# Altium project MBoard.PrjPcb (part 2 of 2)

## Sheet fpga-prom.SchDoc: FPGA Program Memory
size A4; Author: GAA; Organization: heig-vd; Address1: heig-vd; Address2: Route de Cheseaux 1; Address3: 1401 Yverdon-les-Bains; Address4: Suisse; DocumentNumber: 5; Revision: 1.1; SheetNumber: 5; SheetTotal: 12
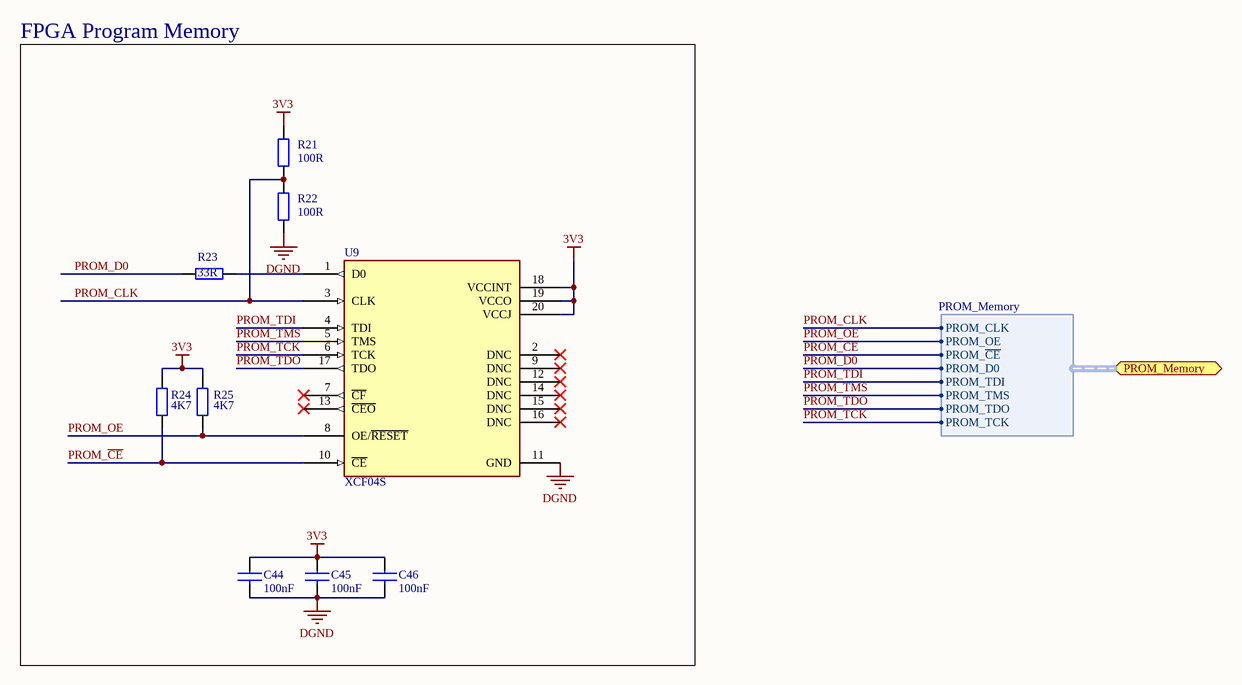
[diagram p7: fpga-prom.SchDoc]

### Parts
C44  100nF  [SM/C_0603]
C45  100nF  [SM/C_0603]
C46  100nF  [SM/C_0603]
R21  100R  [SM/R_0603]
R22  100R  [SM/R_0603]
R23  33R  [SM/R_0603]
R24  4K7  [SM/R_0603]
R25  4K7  [SM/R_0603]
U9  XCF04S  [TSSOP-20]

### Blocks framed on the sheet
FPGA Program Memory: C44-C46 R21-R25 U9

### Ports
PROM_Memory (harness PROM_Memory)

### Harnesses
PROM_Memory: PROM_CLK, PROM_OE, PROM_~{CE}, PROM_D0, PROM_TDI, PROM_TDO, PROM_TCK, PROM_TMS

### Nets
3V3: C44.1 C45.1 C46.1 R21.1 R24.1 R25.1 U9.18(VCCINT) U9.19(VCCO) U9.20(VCCJ)
DGND: C44.2 C45.2 C46.2 R22.2 U9.11(GND)
PROM_~{CE}: R24.2 U9.10(~{CE}) ; port PROM_Memory.PROM_~{CE}  [project net FPGA_DONE_2]
PROM_CLK: R21.2 R22.1 U9.3(CLK) ; port PROM_Memory.PROM_CLK  [project net FPGA_CCLK]
PROM_D0: R23.1 ; port PROM_Memory.PROM_D0  [project net FPGA_DIN]
PROM_OE: R25.2 U9.8(OE/~{RESET}) ; port PROM_Memory.PROM_OE  [project net FPGA_INIT_B]
PROM_TCK: U9.6(TCK) ; port PROM_Memory.PROM_TCK  [project net FPGA_TCK]
PROM_TDI: U9.4(TDI) ; port PROM_Memory.PROM_TDI  [project net FPGA_TDO]
PROM_TDO: U9.17(TDO) ; port PROM_Memory.PROM_TDO  [project net JTAG_TDO]
PROM_TMS: U9.5(TMS) ; port PROM_Memory.PROM_TMS  [project net FPGA_TMS]
NetR23_2: R23.2 U9.1(D0)

Not connected (* = marked no-connect by the designer): U9 2(DNC)* 7(~{CF})* 9(DNC)* 12(DNC)* 13(~{CEO})* 14(DNC)* 15(DNC)* 16(DNC)*

### Notes on the sheet
- Route de Cheseaux 1
- CH-1401 Yverdon-les-Bains
- Titre:
- Date:
- Projet:
- Revision:
- Sheet
- of
- File:

### Library data of the parts
C44-C46 = 182: Ceramic multi-layer; Manufacturer: AVX; Manufacturer P/N: 0603YC104KAZ2A; ID: 182; Voltage: 16V; Tolerance: ±10%; Value: 100nF; Component Type: Capacitor, non-polarized; Supplier 1: Farnell; Supplier Part Number 1: 7569556; RoHS Compliant: True
R21 R22 = 85: Résistance 0603 63mW 1% 100R; Manufacturer: Multicomp; Manufacturer P/N: MC 0.036mW 0603 1% 100R; ID: 85; Voltage: 50V; Value: 100R; Component Type: Résistance; Power: 63mW; Tolerance: 1%; Supplier 1: Farnell; Supplier Part Number 1: 9330364; RoHS Compliant: False
R23 = 73: Résistance 0603 63mW 1% 33R; Manufacturer: Multicomp; Manufacturer P/N: MC 0.036mW 0603 1% 33R; ID: 73; Voltage: 50V; Value: 33R; Component Type: Résistance; Power: 63mW; Tolerance: 1%; Supplier 1: Farnell; Supplier Part Number 1: 9331050; RoHS Compliant: False
R24 R25 = 125: Résistance 0603 63mW 1% 4K7; Manufacturer: Multicomp; Manufacturer P/N: MC 0.036mW 0603 1% 4K7; ID: 125; Voltage: 50V; Value: 4K7; Component Type: Résistance; Power: 63mW; Tolerance: 1%; Supplier 1: Farnell; Supplier Part Number 1: 9331247; RoHS Compliant: False
U9 = XCF04S: Platform Flash In-System Programmable Configuration PROMs; Manufacturer: Xilinx; Manufacturer P/N: XCF04SVOG20C; ID: 2190; Pitch: 0,65mm; Value: XCF04SVOG20C; Component Type: IC; Category: Memory; Package Type: TSSOP-20; Supplier 1: Digi-Key; Supplier Part Number 1: 122-1288-5-ND; RoHS Compliant: True; ComponentLink1Description: Datasheet; ComponentLink1URL: http://www.xilinx.com/support/documentation/data_sheets/ds123.pdf; ComponentLink2Description: Supplier; ComponentLink2URL: http://www.digikey.fr/product-search/fr?keywords=122-1288-5-ND

## Sheet jtag.SchDoc: JTAG
size A4; Author: GAA; Organization: heig-vd; Address1: heig-vd; Address2: Route de Cheseaux 1; Address3: 1401 Yverdon-les-Bains; Address4: Suisse; DocumentNumber: 6; Revision: 1.1; SheetNumber: 6; SheetTotal: 12; PageSetup: Record=PageOptions|CenterHorizontal=True|CenterVertical=True|PrintScale=1.00|XCorrection=1.00|YCorrection=1.00|PrintKind=1|BorderSize=5000000|LeftOffset=0|BottomOffset=0|Orientation=2|PaperLength=1000|PaperWidth=1000|Scale=100|PaperSource=7|PrintQuality=-3|MediaType=1|DitherType=10|PrintScaleMode=1|PaperKind=A4 (210 x 297 mm)|PaperIndex=9
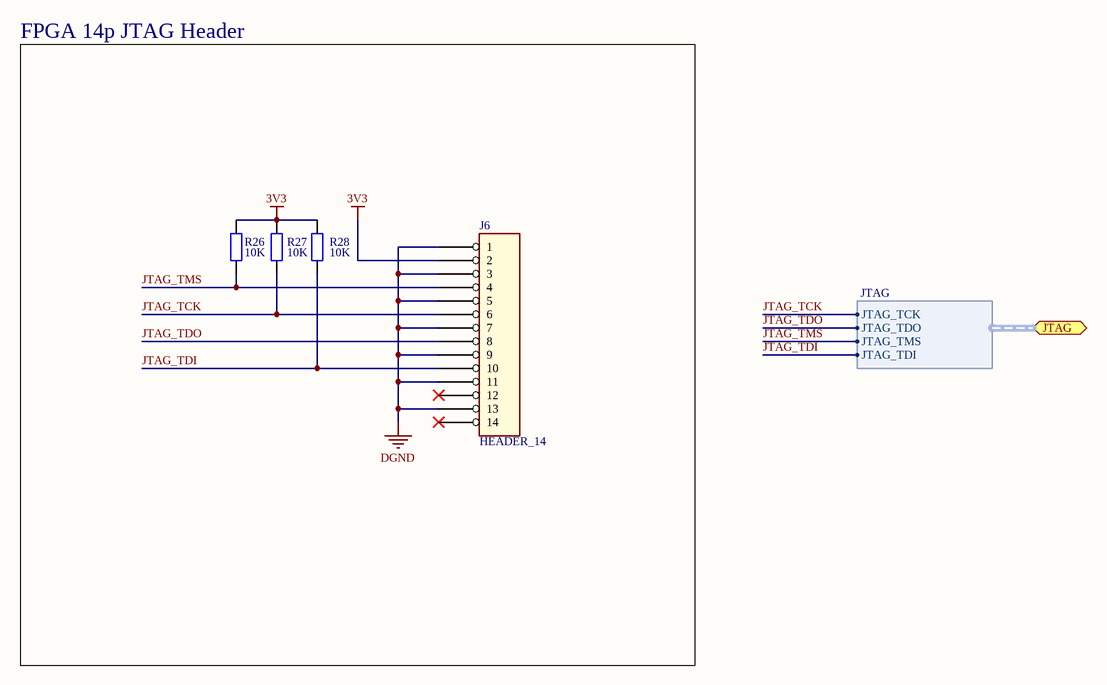
[diagram p8: jtag.SchDoc]

### Parts
J6  HEADER_14  [Male Box Header 2mm 14P]
R26  10K  [SM/R_0603]
R27  10K  [SM/R_0603]
R28  10K  [SM/R_0603]

### Blocks framed on the sheet
FPGA 14p JTAG Header: J6 R26-R28

### Ports
JTAG (harness JTAG)

### Harnesses
JTAG: JTAG_TCK, JTAG_TDI, JTAG_TDO, JTAG_TMS

### Nets
3V3: J6.2 R26.1 R27.1 R28.1
DGND: J6.1 J6.3 J6.5 J6.7 J6.9 J6.11 J6.13
JTAG_TCK: J6.6 R27.2 ; port JTAG.JTAG_TCK  [project net FPGA_TCK]
JTAG_TDI: J6.10 R28.2 ; port JTAG.JTAG_TDI  [project net FPGA_TDI]
JTAG_TDO: J6.8 ; port JTAG.JTAG_TDO
JTAG_TMS: J6.4 R26.2 ; port JTAG.JTAG_TMS  [project net FPGA_TMS]

Not connected (* = marked no-connect by the designer): J6 12* 14*

### Notes on the sheet
- Route de Cheseaux 1
- CH-1401 Yverdon-les-Bains
- Titre:
- Date:
- Projet:
- Revision:
- Sheet
- of
- File:

### Library data of the parts
J6 = 354: Male Box Header 14 poles; Manufacturer: Würth; Manufacturer P/N: 625 014 216 21; ID: 354; Pitch: 2mm; Component Type: Connecteur 2mm; Connector Type: HEADER14; Supplier 1: Würth Elektronik; Supplier Part Number 1: 625 014 216 21; ComponentLink1Description: Datasheet; ComponentLink1URL: http://katalog.we-online.de/em/datasheet/6250xx21621.pdf; ComponentLink2Description: Supplier; ComponentLink2URL: http://katalog.we-online.de/en/em/BHD_2_00_MALE_BOX_HEADER_6250XX21621/62501021621?m=n&sp=http%3A%2F%2Fwww.we-online.de%2Fweb%2Fen%2Felectronic_components%2Fsearchpage_PBS.php%3Fsearch%3D62501021621&_ga=1.208171730.1533585039.1428388574; RoHS Compliant1: True
R26-R28 = 133: Résistance 0603 63mW 1% 10K; Manufacturer: Multicomp; Manufacturer P/N: MC 0.036mW 0603 1% 10K; ID: 133; Voltage: 50V; Value: 10K; Component Type: Résistance; Power: 63mW; Tolerance: 1%; Supplier 1: Farnell; Supplier Part Number 1: 9330399; RoHS Compliant: False

## Sheet misc.SchDoc: Misc Components
size A4; Organization: heig-vd; Address1: heig-vd; Address2: Route de Cheseaux 1; Address3: 1401 Yverdon-les-Bains; Address4: Suisse; DocumentNumber: 12; Revision: 1.1; SheetNumber: 12; SheetTotal: 12
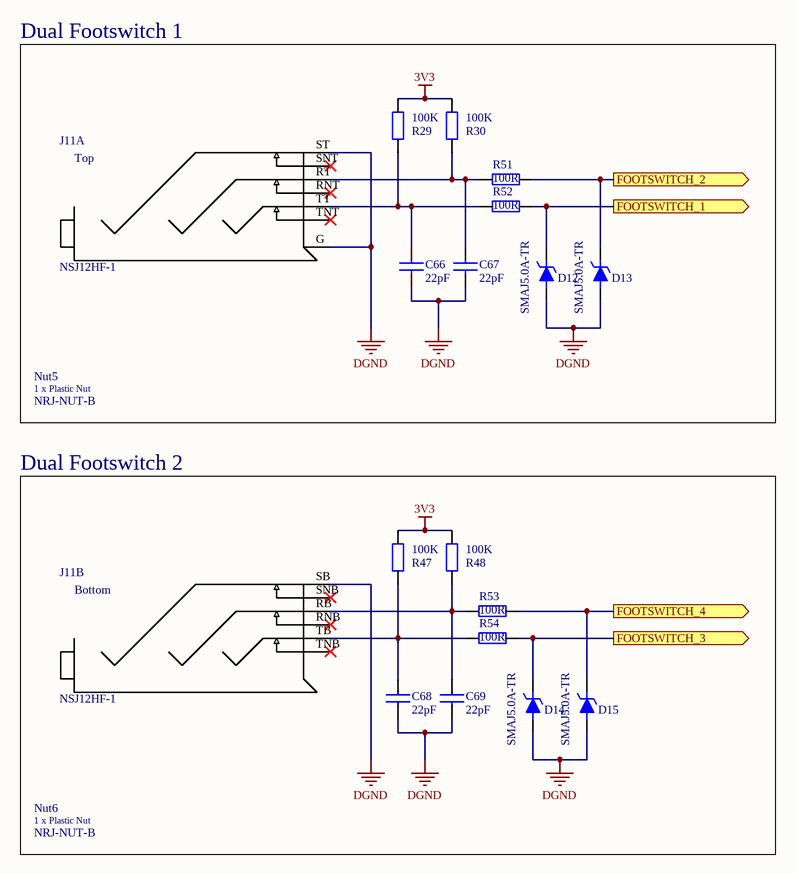
[diagram p9: misc.SchDoc]

### Parts
C66  22pF  [SM/C_0603]
C67  22pF  [SM/C_0603]
C68  22pF  [SM/C_0603]
C69  22pF  [SM/C_0603]
D12  SMAJ5.0A-TR  [SM/D_DO214-AC (SMA)]
D13  SMAJ5.0A-TR  [SM/D_DO214-AC (SMA)]
D14  SMAJ5.0A-TR  [SM/D_DO214-AC (SMA)]
D15  SMAJ5.0A-TR  [SM/D_DO214-AC (SMA)]
J11  NSJ12HF-1  [NSJ12HF-1]  (parts A,B of 2)
Nut5  NRJ-NUT-B  (mechanical)
Nut6  NRJ-NUT-B  (mechanical)
R29  100K  [SM/R_0603]
R30  100K  [SM/R_0603]
R47  100K  [SM/R_0603]
R48  100K  [SM/R_0603]
R51  100R  [SM/R_0603]
R52  100R  [SM/R_0603]
R53  100R  [SM/R_0603]
R54  100R  [SM/R_0603]

### Blocks framed on the sheet
Dual Footswitch 1: C66 C67 D12 D13 J11 Nut5 R29 R30 R51 R52
Dual Footswitch 2: C68 C69 D14 D15 J11 Nut6 R47 R48 R53 R54

### Ports
FOOTSWITCH_1 (out), FOOTSWITCH_2 (out), FOOTSWITCH_3 (out), FOOTSWITCH_4 (out)

### Nets
3V3: R29.1 R30.1 R47.1 R48.1
DGND: C66.2 C67.2 C68.2 C69.2 D12.1(A) D13.1(A) D14.1(A) D15.1(A) J11.G J11.SB J11.ST
NetC66_1: C66.1 J11.TT R29.2 R52.1
NetC67_1: C67.1 J11.RT R30.2 R51.1
NetC68_1: C68.1 J11.TB R47.2 R54.1
NetC69_1: C69.1 J11.RB R48.2 R53.1
NetD12_2: D12.2(C) R52.2 ; port FOOTSWITCH_1
NetD13_2: D13.2(C) R51.2 ; port FOOTSWITCH_2
NetD14_2: D14.2(C) R54.2 ; port FOOTSWITCH_3
NetD15_2: D15.2(C) R53.2 ; port FOOTSWITCH_4

Not connected (* = marked no-connect by the designer): J11 RNB* RNT* SNB* SNT* TNB* TNT*

### Notes on the sheet
- Route de Cheseaux 1
- CH-1401 Yverdon-les-Bains
- Titre:
- Date:
- Projet:
- Revision:
- Sheet
- of
- File:
- (in symbol Jack 6.35 NSJ12HF-1, part A) Top
- (in symbol Jack 6.35 NSJ12HF-1, part B) Bottom
- (in symbol Jack 6.35 Plastic Nut) 1 x Plastic Nut

### Library data of the parts
C66-C69 = 216: Capacitor, ceramic; Manufacturer: Kemet; Manufacturer P/N: C0603C220J5GAC; ID: 216; Voltage: 50V; Tolerance: ±5%; Value: 22pF; Component Type: Capacitor, non-polarized; Supplier 1: Farnell; Supplier Part Number 1: 1414622; RoHS Compliant: True
D12-D15 = 556: Transil™ diode; Manufacturer: STMicroelectronics; ID: 556; Component Type: Diode TVS; Manufacturer P/N: SMAJ5.0A-TR; Value: SMAJ5.0A-TR; Supplier 1: Farnell; Supplier Part Number 1: 1467627; RoHS Compliant: False
J11 = Jack 6.35 NSJ12HF-1: Neutronik 2xJack 6.35 connector; Supplier 1: Allied; Supplier 2: Newark; Supplier 3: Mouser; Supplier Part Number 1: 70549361; Supplier Part Number 2: 10J0817; Supplier Part Number 3: 568-NSJ12HF-1
Nut5 Nut6 = Jack 6.35 Plastic Nut: Plastic Nut to fasten 6.35 jack; Manufacturer: Neutrik; Manufacturer P/N: NRJ-NUT-B; Supplier 1: Mouser; Supplier 2: Allied; Supplier Part Number 1: 550-1005; Supplier Part Number 2: 70088339
R29 R30 R47 R48 = 157: Résistance 0603 63mW 1% 100K; Manufacturer: Multicomp; Manufacturer P/N: MC 0.036mW 0603 1% 100K; ID: 157; Voltage: 50V; Value: 100K; Component Type: Résistance; Power: 63mW; Tolerance: 1%; Supplier 1: Farnell; Supplier Part Number 1: 9330402; RoHS Compliant: False
R51-R54 = 85: as R21 on sheet fpga-prom; Value: 100R; Component Type: Résistance; Power: 63mW; Tolerance: 1%; Supplier 1: Farnell; Supplier Part Number 1: 9330364; RoHS Compliant: False

## Sheet audio-connectors.SchDoc: Audio Connectors
size A4; Organization: heig-vd; Address1: heig-vd; Address2: Route de Cheseaux 1; Address3: 1401 Yverdon-les-Bains; Address4: Suisse; DocumentNumber: 10; Revision: 1.1; SheetNumber: 10; SheetTotal: 12
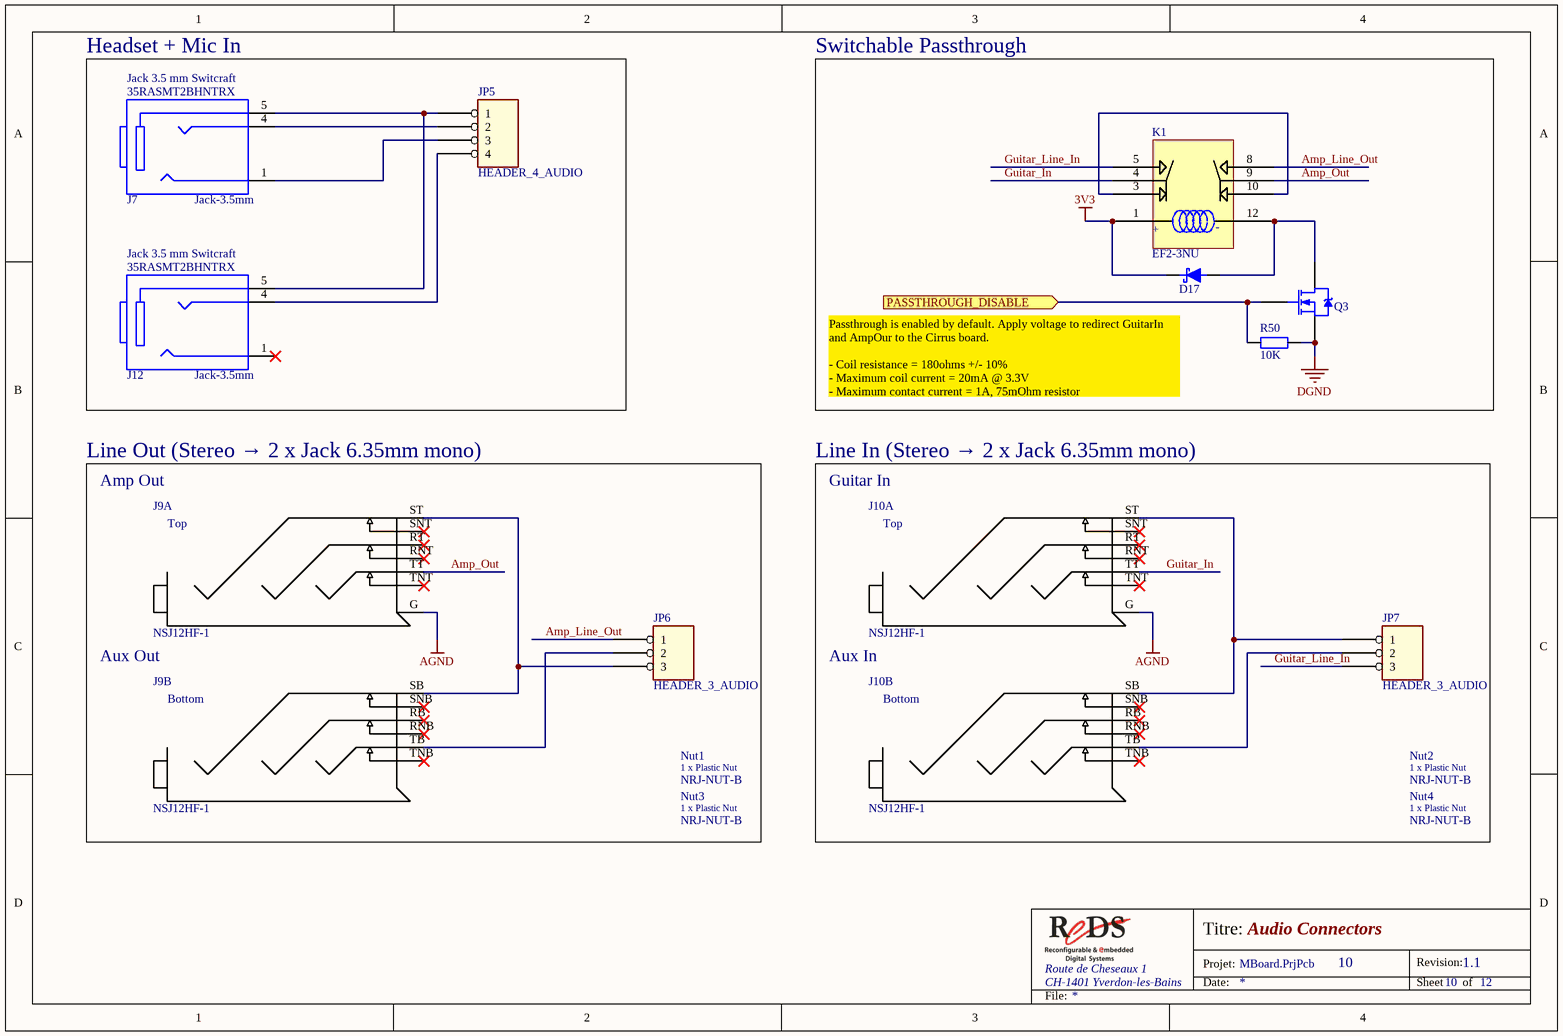
[diagram p10: audio-connectors.SchDoc]

### Parts
D17  B340A  [SM/D_DO214-AC (SMA)]  (value not drawn)
J7  Jack-3.5mm  [CON_JACK_3.5MM_SMD_Switchcraft_35RASMT2BHNTRX]
J9  NSJ12HF-1  [NSJ12HF-1]  (parts A,B of 2)
J10  NSJ12HF-1  [NSJ12HF-1]  (parts A,B of 2)
J12  Jack-3.5mm  [CON_JACK_3.5MM_SMD_Switchcraft_35RASMT2BHNTRX]
JP5  HEADER_4_AUDIO  [HEADER4_WIRE]  (no BOM)
JP6  HEADER_3_AUDIO  [HEADER3_WIRE]  (no BOM)
JP7  HEADER_3_AUDIO  [HEADER3_WIRE]  (no BOM)
K1  EF2-3NU  [EF2-NU]
Nut1  NRJ-NUT-B  (mechanical)
Nut2  NRJ-NUT-B  (mechanical)
Nut3  NRJ-NUT-B  (mechanical)
Nut4  NRJ-NUT-B  (mechanical)
Q3  FDV301N  [SOT23]  (value not drawn)
R50  10K  [SM/R_0603]

### Blocks framed on the sheet
Headset + Mic In: J7 J12 JP5
Switchable Passthrough: D17 K1 Q3 R50
Line Out (Stereo → 2 x Jack 6.35mm mono): J9 JP6 Nut1 Nut3
Line In (Stereo → 2 x Jack 6.35mm mono): J10 JP7 Nut2 Nut4

### Ports
PASSTHROUGH_DISABLE (in)

### Nets
3V3: D17.2(C) K1.1
AGND: J9.G J10.G
DGND: Q3.2(S) R50.2
Amp_Line_Out: JP6.1 K1.8
Amp_Out: J9.TT K1.9
Guitar_In: J10.TT K1.4
Guitar_Line_In: JP7.3 K1.5
NetD17_1: D17.1(A) K1.12 Q3.3(D)
NetJ7_1: J7.1 JP5.3
NetJ7_4: J7.4 JP5.2
NetJ7_5: J7.5(5-GND) J12.5(5-GND) JP5.1
NetJ9_SB: J9.SB J9.ST JP6.3
NetJ9_TB: J9.TB JP6.2
NetJ10_SB: J10.SB J10.ST JP7.1
NetJ10_TB: J10.TB JP7.2
NetJ12_4: J12.4 JP5.4
NetK1_3: K1.3 K1.10
NetQ3_1: Q3.1(G) R50.1 ; port PASSTHROUGH_DISABLE

Not connected (* = marked no-connect by the designer): J9 RB* RNB* RNT* RT* SNB* SNT* TNB* TNT*; J10 RB* RNB* RNT* RT* SNB* SNT* TNB* TNT*; J12 1*

### Notes on the sheet
- (near D17) Passthrough is enabled by default. Apply voltage to redirect GuitarIn and AmpOur to the Cirrus board.
  - Coil resistance = 180ohms +/- 10%
  - Maximum coil current = 20mA @ 3.3V
  - Maximum contact current = 1A, 75mOhm resistor
- Amp Out
- Guitar In
- Aux Out
- Aux In
- Route de Cheseaux 1
- CH-1401 Yverdon-les-Bains
- Titre:
- Date:
- Projet:
- Revision:
- Sheet
- of
- File:
- (in symbol 402) Jack 3.5 mm Switcraft
- (in symbol EF2-3NU) +; -
- (in symbol Jack 6.35 NSJ12HF-1, part A) Top
- (in symbol Jack 6.35 NSJ12HF-1, part B) Bottom
- (in symbol Jack 6.35 Plastic Nut) 1 x Plastic Nut

### Library data of the parts
D17 = Diode Schottky B340A: DIODE SCHOTTKY 30V 3A SMA; Supplier 1: Newark; Supplier 2: Mouser; Supplier 3: Allied; Supplier 4: Arrow; Supplier 5: Farnell; Supplier 6: Digi-Key; Supplier 7: Digi-Key; Supplier Part Number 1: 12T1465; Supplier Part Number 2: 621-B340A-F; Supplier Part Number 3: 70437566; Supplier Part Number 5: 1843668; Supplier Part Number 6: B340A-FDICT-ND; Supplier Part Number 7: B340A-FDIDKR-ND
J7 J12 = 402: Connecteur Jack 3.5mm; Manufacturer: Switchcraft; Manufacturer P/N: 35RASMT2BHNTRX; ID: 402; Component Type: Connecteur Jack; Connector Type: Jack 3.5mm; Supplier 1: Digi-Key; Supplier Part Number 1: SC1489-1-ND; Supplier 2: Mouser; Supplier Part Number 2: 502-35RASMT2BHNTRX; ComponentLink1Description: Datasheet; ComponentLink1URL: http://www.mouser.com/ds/2/393/35rasmt2bhntrx_cd-477521.pdf; ComponentLink2Description: Supplier; ComponentLink2URL: http://www.mouser.ch/ProductDetail/Switchcraft/35RASMT2BHNTRX/?qs=%2fha2pyFadugBYbEyIApCbsLN6HSegI9LkYs0hFESYdE9%252b%2fmOK%2fulEw%3d%3d; RoHS Compliant1: True
J9 J10 = Jack 6.35 NSJ12HF-1: Neutronik 2xJack 6.35 connector; Supplier 1: Allied; Supplier 2: Newark; Supplier 3: Mouser; Supplier Part Number 1: 70549361; Supplier Part Number 2: 10J0817; Supplier Part Number 3: 568-NSJ12HF-1
JP5 = HEADER_4_AUDIO: Manufacturer: REDS; RoHS Compliant1: True
JP6 JP7 = HEADER_3_AUDIO: Manufacturer: REDS; RoHS Compliant1: True
K1 = EF2-3NU: Miniature Signal Relay
Nut1-Nut4 = Jack 6.35 Plastic Nut: as Nut5 on sheet misc; Manufacturer P/N: NRJ-NUT-B; Supplier 1: Mouser; Supplier 2: Allied; Supplier Part Number 1: 550-1005; Supplier Part Number 2: 70088339
Q3 = 2083: MOSFET N-CH 25V 220MA SOT-23; Manufacturer: Fairchild Semiconductor; ID: 2083; Component Type: Transistor MOSFET_N; Manufacturer P/N: FDV301N; Value: FDV301N; Supplier 1: Digi-Key; Supplier Part Number 1: FDV301NCT-ND; Supplier 2: Mouser; Supplier Part Number 2: 512-FDV301N; RoHS Compliant: True; ComponentLink1Description: Datasheet; ComponentLink1URL: http://www.fairchildsemi.com/ds/FD/FDV301N.pdf; ComponentLink2Description: Supplier; ComponentLink2URL: http://www.digikey.fr/product-detail/fr/FDV301N/FDV301NCT-ND/458954
R50 = 133: as R26 on sheet jtag; Value: 10K; Component Type: Résistance; Power: 63mW; Tolerance: 1%; Supplier 1: Farnell; Supplier Part Number 1: 9330399; RoHS Compliant: False

## Sheet rgb-leds.SchDoc: RGB LEDs
size A4; Organization: heig-vd; Address1: heig-vd; Address2: Route de Cheseaux 1; Address3: 1401 Yverdon-les-Bains; Address4: Suisse; DocumentNumber: 11; Revision: 1.1; SheetNumber: 11; SheetTotal: 12
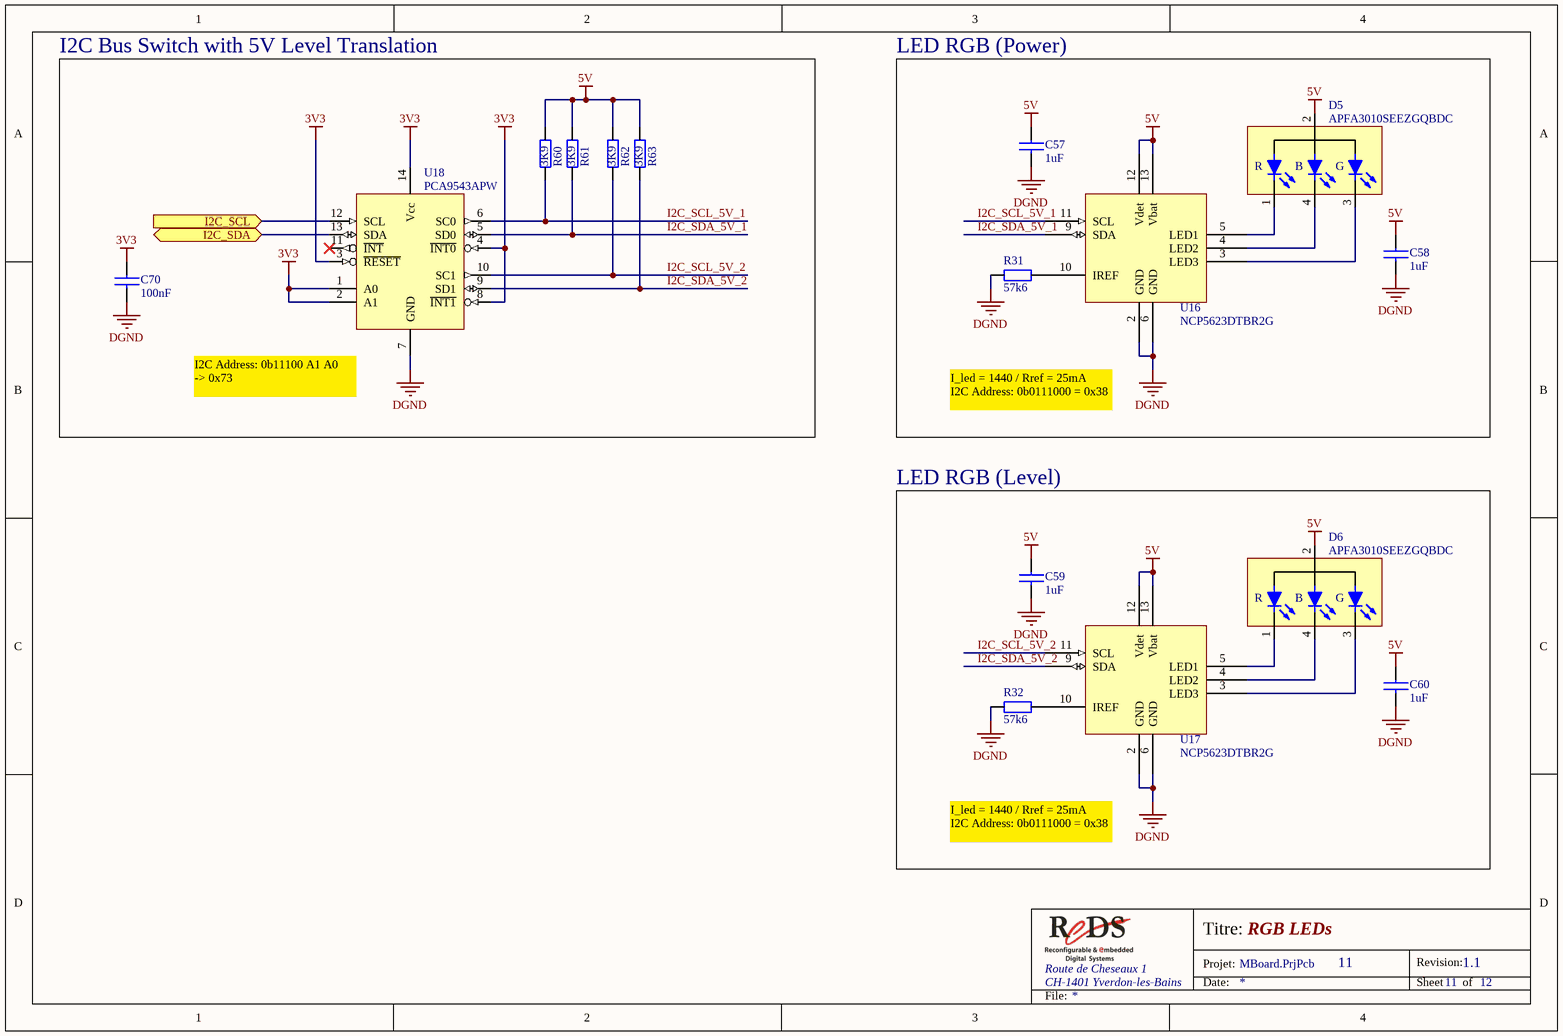
[diagram p11: rgb-leds.SchDoc]

### Parts
C57  1uF  [SM/C_0603]
C58  1uF  [SM/C_0603]
C59  1uF  [SM/C_0603]
C60  1uF  [SM/C_0603]
C70  100nF  [SM/C_0603]
D5  APFA3010SEEZGQBDC  [APFA3010]
D6  APFA3010SEEZGQBDC  [APFA3010]
R31  57k6  [SM/R_0603]
R32  57k6  [SM/R_0603]
R60  3K9  [SM/R_0603]
R61  3K9  [SM/R_0603]
R62  3K9  [SM/R_0603]
R63  3K9  [SM/R_0603]
U16  NCP5623DTBR2G  [TSSOP-14]
U17  NCP5623DTBR2G  [TSSOP-14]
U18  PCA9543APW  [TSSOP-14]

### Blocks framed on the sheet
I2C Bus Switch with 5V Level Translation: C70 R60-R63 U18
LED RGB (Power): C57 C58 D5 R31 U16
LED RGB (Level): C59 C60 D6 R32 U17

### Ports
I2C_SCL (in), I2C_SDA (bidir)

### Nets
3V3: C70.1 U18.1(A0) U18.2(A1) U18.3(~{RESET}) U18.4(~{INT0}) U18.8(~{INT1}) U18.14(Vcc)
5V: C57.1 C58.1 C59.1 C60.1 D5.2(A) D6.2(A) R60.1 R61.1 R62.1 R63.1 U16.12(Vdet) U16.13(Vbat) U17.12(Vdet) U17.13(Vbat)
DGND: C57.2 C58.2 C59.2 C60.2 C70.2 R31.1 R32.1 U16.2(GND) U16.6(GND) U17.2(GND) U17.6(GND) U18.7(GND)
I2C_SCL: U18.12(SCL) ; port I2C_SCL
I2C_SCL_5V_1: R60.2 U16.11(SCL) U18.6(SC0)
I2C_SCL_5V_2: R62.2 U17.11(SCL) U18.10(SC1)
I2C_SDA: U18.13(SDA) ; port I2C_SDA
I2C_SDA_5V_1: R61.2 U16.9(SDA) U18.5(SD0)
I2C_SDA_5V_2: R63.2 U17.9(SDA) U18.9(SD1)
NetD5_1: D5.1(C) U16.5(LED1)
NetD5_3: D5.3(C) U16.3(LED3)
NetD5_4: D5.4(C) U16.4(LED2)
NetD6_1: D6.1(C) U17.5(LED1)
NetD6_3: D6.3(C) U17.3(LED3)
NetD6_4: D6.4(C) U17.4(LED2)
NetR31_2: R31.2 U16.10(IREF)
NetR32_2: R32.2 U17.10(IREF)

Not connected (* = marked no-connect by the designer): U16 1(IC) 7(NC) 8(NC) 14(IC); U17 1(IC) 7(NC) 8(NC) 14(IC); U18 11(~{INT})*

### Notes on the sheet
- (near U18) I2C Address: 0b11100 A1 A0
  -> 0x73
- I_led = 1440 / Rref = 25mA
  I2C Address: 0b0111000 = 0x38
- Route de Cheseaux 1
- CH-1401 Yverdon-les-Bains
- Titre:
- Date:
- Projet:
- Revision:
- Sheet
- of
- File:
- (in symbol Led RGB RA) R; B; G

### Library data of the parts
C57-C60 = 5: Ceramic multi-layer; Manufacturer: MURATA; Manufacturer P/N: GRM188R61A105KA61D; ID: 5; Voltage: 10V; Tolerance: ±10%; Value: 1uF; Component Type: Capacitor, non-polarized; Supplier 1: Digi-Key; Supplier Part Number 1: 490-1543-2-ND; Supplier 2: Mouser; Supplier Part Number 2: 81-GRM39R105K10; RoHS Compliant: True; ComponentLink1Description: Datasheet; ComponentLink1URL: http://psearch.murata.com/capacitor/product/GRM188R61A105KA61%23.pdf; ComponentLink2Description: Supplier; ComponentLink2URL: http://www.digikey.fr/product-detail/fr/GRM188R61A105KA61D/490-1543-1-ND/587782
C70 = 182: as C44 on sheet fpga-prom; Value: 100nF; Component Type: Capacitor, non-polarized; Supplier 1: Farnell; Supplier Part Number 1: 7569556; RoHS Compliant: True
D5 D6 = Led RGB RA: 3.0x1.0mm RIGHT ANGLE SMD CHIP LED  LAMP; Supplier 1: Mouser; Supplier 2: Digi-Key; Supplier Part Number 1: 604-APFA3010SEEZGQBD; Supplier Part Number 2: 754-1649-6-ND
R31 R32 = Res_57k6: Résistance 0603 100mW 1% 57k6; Manufacturer: Panasonic; Manufacturer P/N: ERJ-3EKF5762V; Voltage: 75V; Value: 57k6; Component Type: Résistance; Power: 100mW; Tolerance: 1%; RoHS Compliant: True; Supplier 1: Allied; Supplier 2: Mouser; Supplier 3: Digi-Key; Supplier Part Number 1: 70265864; Supplier Part Number 2: 667-ERJ-3EKF5762V; Supplier Part Number 3: P57.6KHDKR-ND
R60-R63 = 123: Résistance 0603 63mW 1% 3K9; Manufacturer: Multicomp; Manufacturer P/N: MC 0.036mW 0603 1% 3K9; ID: 123; Voltage: 50V; Value: 3K9; Component Type: Résistance; Power: 63mW; Tolerance: 1%; Supplier 1: Farnell; Supplier Part Number 1: 9331140; RoHS Compliant: False
U16 U17 = NCP5623DTBR2G: Triple Output I2C Controlled RGB LED Driver; Supplier 1: Mouser; Supplier 2: Arrow; Supplier 3: Digi-Key; Supplier Part Number 1: 863-NCP5623DTBR2G; Supplier Part Number 2: 9JGsNSaWsajKjxt30OCY0Xm9Z4kl474dJyr_l9lYFAQ; Supplier Part Number 3: NCP5623DTBR2GOSCT-ND
U18 = PCA9543APW: 2-Channel I2C Bus Switch With Interrupt Logic and Reset; Supplier 1: Arrow; Supplier 2: Digi-Key; Supplier Part Number 1: CXrcX0Ksgu2EXoGfPTOdms8Pzusfh2ExCB2AT9PF3AQ; Supplier Part Number 2: 296-22770-1-ND

## Nets that join several sheets
3V3: rpi (8 pins), fpga (45 pins), midi (C42.2 R18.1 U7.8), power (7 pins), control-pedal (6 pins), fpga-prom (9 pins), jtag (J6.2 R26.1 R27.1 R28.1), misc (R29.1 R30.1 R47.1 R48.1), audio-connectors (D17.2 K1.1), rgb-leds (7 pins)
3V3_RPi1: rpi (J1.17), cirrus-audio (J2.17)
3V3_RPi2: rpi (J1.1), cirrus-audio (J2.1)
5V: rpi (J1.2 J1.4), cirrus-audio (J2.2 J2.4), midi (C71.2 J5.4 U10.5), power (7 pins), control-pedal (13 pins), rgb-leds (14 pins)
8V: power (C47.1 U8.1), control-pedal (C50.1 U12.24)
+1V2: fpga (11 pins), power (C9.1 U5.5)
AGND: control-pedal (27 pins), audio-connectors (J9.G J10.G)
DGND: rpi (19 pins), fpga (46 pins), cirrus-audio (8 pins), midi (6 pins), power (28 pins), control-pedal (8 pins), fpga-prom (5 pins), jtag (7 pins), misc (11 pins), audio-connectors (Q3.2 R50.2), rgb-leds (12 pins)
CIRRUS.MCLK: rpi (J1.7), cirrus-audio (J2.7)
CIRRUS.WM5102_GPIO3: rpi (J1.22), cirrus-audio (J2.22)
CIRRUS.WM5102_GPIO5: rpi (J1.18), cirrus-audio (J2.18)
CIRRUS.WM5102_IRQ: rpi (J1.13), cirrus-audio (J2.13)
CIRRUS.WM5102_LDO_en: rpi (J1.15), cirrus-audio (J2.15)
CIRRUS.WM5102_RST: rpi (J1.11), cirrus-audio (J2.11)
CIRRUS.WM8804_I2C_CFG: rpi (J1.33), cirrus-audio (J2.33)
CIRRUS.WM8804_IF_CFG: rpi (J1.16), cirrus-audio (J2.16)
CIRRUS.WM8804_RST: rpi (J1.24), cirrus-audio (J2.24)
FPGA_CCLK: fpga (U6.70), fpga-prom (R21.2 R22.1 U9.3)
FPGA_DIN: fpga (U6.65), fpga-prom (R23.1)
FPGA_DONE_2: fpga (U6.71), fpga-prom (R24.2 U9.10)
FPGA_INIT_B: fpga (U6.39), fpga-prom (R25.2 U9.8)
FPGA_nReset: rpi (U1.10), fpga (R57.1 U6.37)
FPGA_TCK: fpga (U6.109), fpga-prom (U9.6), jtag (J6.6 R27.2)
FPGA_TDI: fpga (U6.110), jtag (J6.10 R28.2)
FPGA_TDO: fpga (U6.106), fpga-prom (U9.4)
FPGA_TMS: fpga (U6.107), fpga-prom (U9.5), jtag (J6.4 R26.2)
I2C_SCL: rpi (J1.5 U1.1), fpga (U6.23), cirrus-audio (J2.5), control-pedal (U12.27 U14.5), rgb-leds (U18.12)
I2C_SDA: rpi (J1.3 U1.2), fpga (U6.24), cirrus-audio (J2.3), control-pedal (U12.26 U14.4), rgb-leds (U18.13)
JTAG_TDO: fpga-prom (U9.17), jtag (J6.8)
NetD12_2: rpi (U1.14), misc (D12.2 R52.2)
NetD13_2: rpi (U1.16), misc (D13.2 R51.2)
NetD14_2: rpi (U1.15), misc (D14.2 R54.2)
NetD15_2: rpi (U1.17), misc (D15.2 R53.2)
NetJ1_8: rpi (J1.8), midi (U10.2)
NetJ1_10: rpi (J1.10), midi (R18.2 U7.6)
NetJ1_12: mboard (R35.1), rpi (J1.12)
NetJ1_26: rpi (J1.26), cirrus-audio (J2.26)
NetJ1_29: mboard (JP4.2), rpi (J1.29)
NetJ1_31: rpi (J1.31), fpga (U6.12)
NetJ1_32: mboard (JP4.1), rpi (J1.32)
NetJ1_35: mboard (R37.1), rpi (J1.35)
NetJ1_36: mboard (JP4.4), rpi (J1.36)
NetJ1_38: mboard (R41.1), rpi (J1.38)
NetJ1_40: mboard (R39.1), rpi (J1.40)
NetJ2_12: mboard (R36.2), cirrus-audio (J2.12)
NetJ2_27: rpi (JP1.1), cirrus-audio (J2.27)
NetJ2_28: rpi (JP2.1), cirrus-audio (J2.28)
NetJ2_35: mboard (R38.2), cirrus-audio (J2.35)
NetJ2_38: mboard (R42.2), cirrus-audio (J2.38)
NetJ2_40: mboard (R40.2), cirrus-audio (J2.40)
NetJP4_3: mboard (JP4.3), rpi (U1.11)
NetQ3_1: rpi (U1.13), audio-connectors (Q3.1 R50.1)
NetR35_2: mboard (R35.2), fpga (U6.134)
NetR36_1: mboard (R36.1), fpga (U6.126)
NetR37_2: mboard (R37.2), fpga (U6.133)
NetR38_1: mboard (R38.1), fpga (U6.124)
NetR39_2: mboard (R39.2), fpga (U6.131)
NetR40_1: mboard (R40.1), fpga (U6.121)
NetR41_2: mboard (R41.2), fpga (U6.132)
NetR42_1: mboard (R42.1), fpga (U6.123)
SPI_BUS.MISO: rpi (J1.21), fpga (U6.15), cirrus-audio (J2.21)
SPI_BUS.MOSI: rpi (J1.19), fpga (U6.16), cirrus-audio (J2.19)
SPI_BUS.SCLK: rpi (J1.23), fpga (U6.14), cirrus-audio (J2.23)
SW8x8_nReset: rpi (U1.12), control-pedal (R44.2 U12.31)